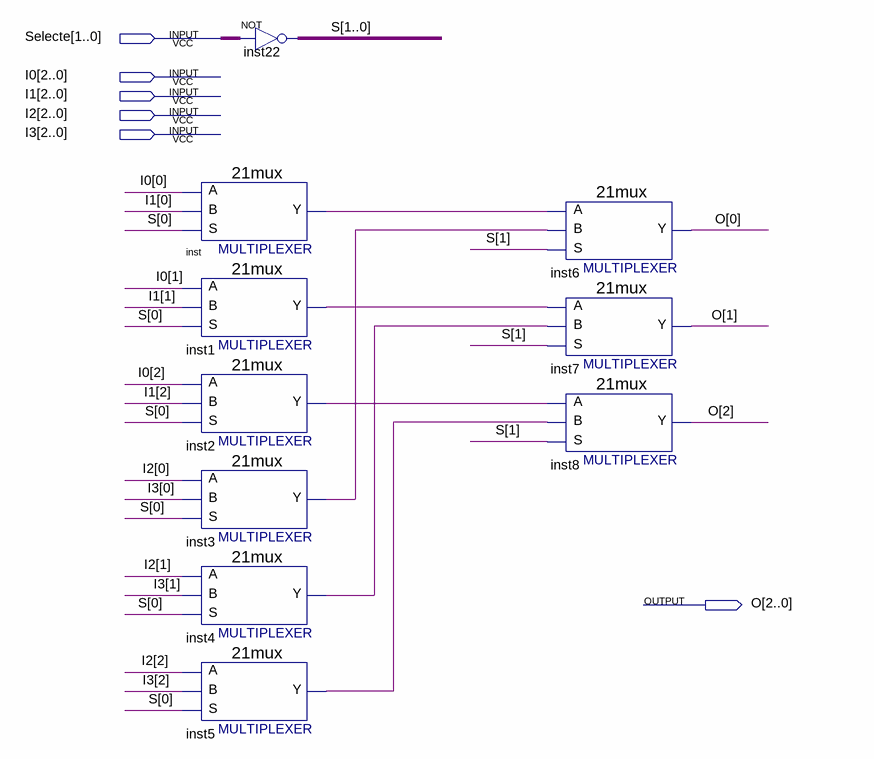
[diagram p0: schematic sheet]
// Quartus schematic mux41_3bit.bdf as structural Verilog: 10 symbols, 6 pins
module mux41_3bit (
  input  [1:0] Selecte,
  input  [2:0] I0,
  input  [2:0] I1,
  input  [2:0] I2,
  input  [2:0] I3,
  output [2:0] O
);

  wire inst1_y, inst2_y, inst3_y, inst4_y, inst5_y, inst_y;
  wire [1:0] S;

  assign S = ~Selecte;  // NOT inst22, 2 bits wide
  \21mux  inst (.S(S[0]), .B(I1[0]), .A(I0[0]), .Y(inst_y));
  \21mux  inst1 (.S(S[0]), .B(I1[1]), .A(I0[1]), .Y(inst1_y));
  \21mux  inst2 (.S(S[0]), .B(I1[2]), .A(I0[2]), .Y(inst2_y));
  \21mux  inst3 (.S(S[0]), .B(I3[0]), .A(I2[0]), .Y(inst3_y));
  \21mux  inst4 (.S(S[0]), .B(I3[1]), .A(I2[1]), .Y(inst4_y));
  \21mux  inst5 (.S(S[0]), .B(I3[2]), .A(I2[2]), .Y(inst5_y));
  \21mux  inst6 (.S(S[1]), .B(inst3_y), .A(inst_y), .Y(O[0]));
  \21mux  inst7 (.S(S[1]), .B(inst4_y), .A(inst1_y), .Y(O[1]));
  \21mux  inst8 (.S(S[1]), .B(inst5_y), .A(inst2_y), .Y(O[2]));
endmodule
